# Altium project u2c.PrjPcb
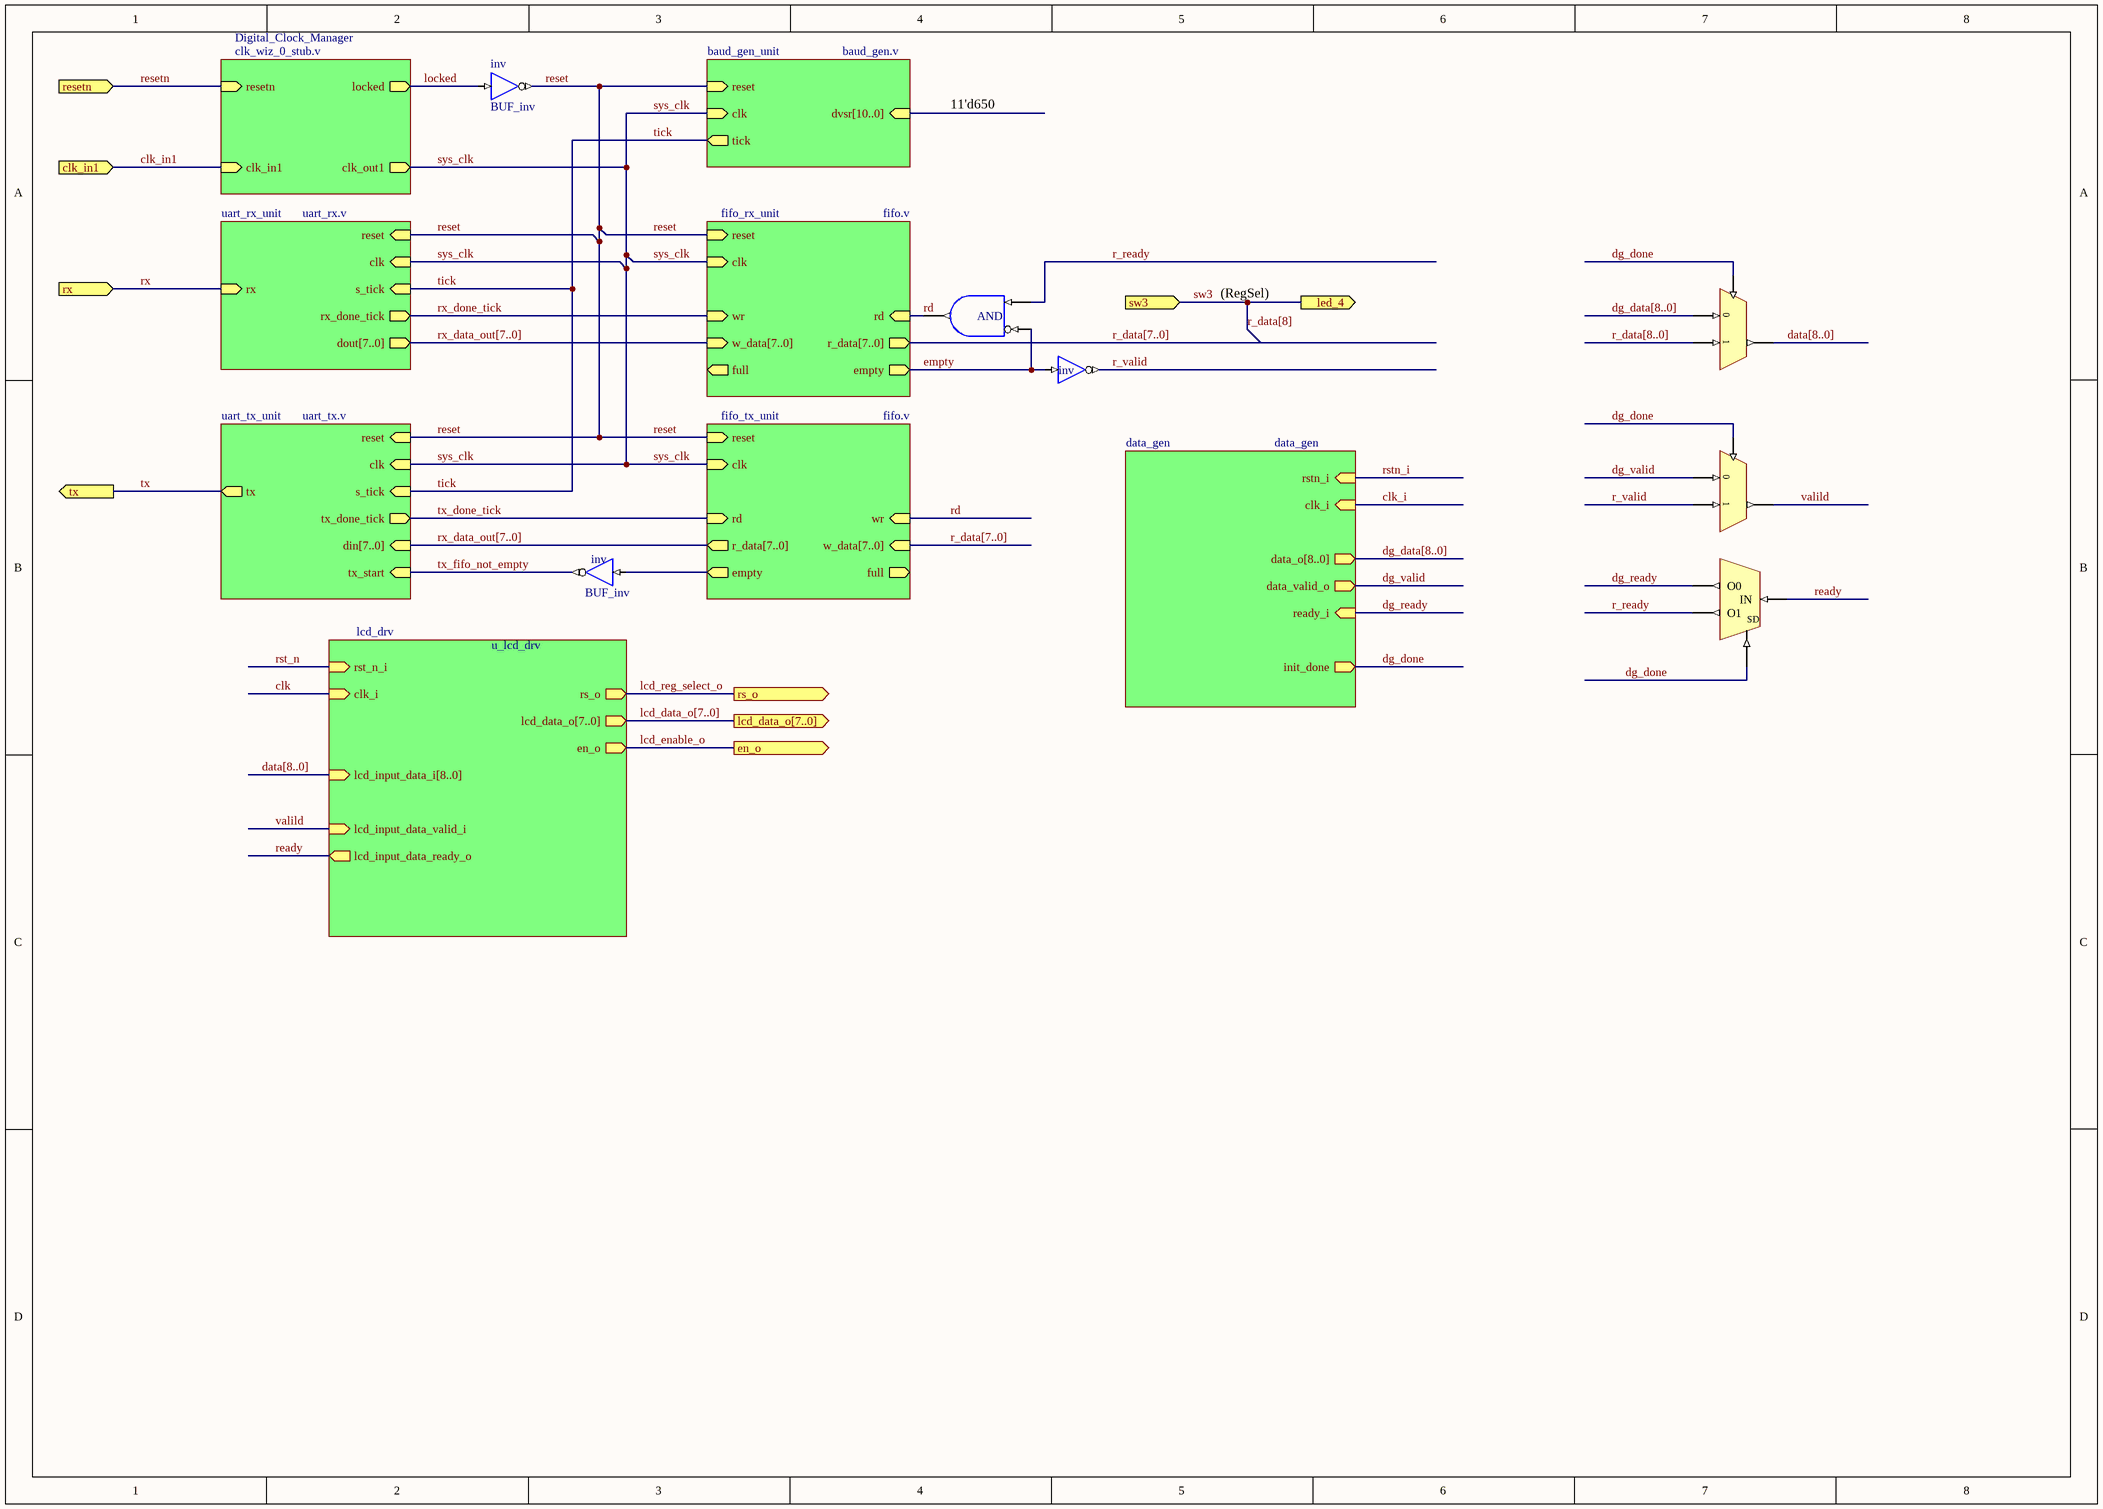
[diagram p0: u2c_bs.SchDoc]
1 sheet, 7 parts. Net scope: hierarchical (ports join the sheet entries above them; power ports are global).

## Sheet u2c_bs.SchDoc
size A3

### Parts
(Parts that share a designator on the sheet are numbered #1, #2 ... from top to bottom, then left to right.)
inv#1  BUF_inv
inv#2  BUF_inv  (value not drawn)
inv#3  BUF_inv
U?#1  AND
U?#2  MUX21  (value not drawn)
U?#3  MUX21  (value not drawn)
U?#4  DEMUX_1x2  (value not drawn)

### Sub-sheets
baud_gen_unit = baud_gen.v (file not in this document): reset (in), clk (in), tick (out), dvsr[10..0] (in)
data_gen = data_gen (file not in this document): data_o[8..0] (out), data_valid_o (out), ready_i (in), clk_i (in), rstn_i (in), init_done (out)
Digital_Clock_Manager = clk_wiz_0_stub.v (file not in this document): resetn (in), clk_in1 (in), locked (out), clk_out1 (out)
fifo_rx_unit = fifo.v (file not in this document): reset (in), clk (in), full (out), w_data[7..0] (in), rd (in), wr (in), r_data[7..0] (out), empty (out)
fifo_tx_unit = fifo.v (file not in this document): reset (in), clk (in), full (out), w_data[7..0] (in), rd (in), wr (in), r_data[7..0] (out), empty (out)
lcd_drv = u_lcd_drv (file not in this document): rs_o (out), lcd_data_o[7..0] (out), en_o (out), clk_i (in), lcd_input_data_i[8..0] (in), lcd_input_data_valid_i (in), lcd_input_data_ready_o (out), rst_n_i (in)
uart_rx_unit = uart_rx.v (file not in this document): reset (in), clk (in), rx (in), s_tick (in), rx_done_tick (out), dout[7..0] (out)
uart_tx_unit = uart_tx.v (file not in this document): reset (in), clk (in), tx (out), s_tick (in), tx_done_tick (out), din[7..0] (in), tx_start (in)

### Ports
clk_in1 (in), en_o (out), lcd_data_o[7..0] (out), led_4 (out), resetn (in), rs_o (out), rx (in), sw3 (in), tx (out)

### Nets
clk: sheet lcd_drv/clk_i
clk_i: sheet data_gen/clk_i
clk_in1: port clk_in1, sheet Digital_Clock_Manager/clk_in1
dg_done: U?#2.SD U?#3.SD U?#4.SD ; sheet data_gen/init_done
dg_ready: U?#4.O0 ; sheet data_gen/ready_i
dg_valid: U?#3.D0 ; sheet data_gen/data_valid_o
empty: inv#2.I U?#1.B ; sheet fifo_rx_unit/empty
lcd_enable_o: port en_o, sheet lcd_drv/en_o
lcd_reg_select_o: port rs_o, sheet lcd_drv/rs_o
locked: inv#1.I ; sheet Digital_Clock_Manager/locked
r_data[8]: port sw3, port led_4  [also labelled sw3]
r_ready: U?#1.A U?#4.O1
r_valid: inv#2.O U?#3.D1
rd: U?#1.Y ; sheet fifo_rx_unit/rd, sheet fifo_tx_unit/wr
ready: U?#4.IN ; sheet lcd_drv/lcd_input_data_ready_o
reset: inv#1.O ; sheet uart_tx_unit/reset, sheet fifo_rx_unit/reset, sheet fifo_tx_unit/reset, sheet baud_gen_unit/reset, sheet uart_rx_unit/reset
resetn: port resetn, sheet Digital_Clock_Manager/resetn
rst_n: sheet lcd_drv/rst_n_i
rstn_i: sheet data_gen/rstn_i
rx: port rx, sheet uart_rx_unit/rx
rx_done_tick: sheet fifo_rx_unit/wr, sheet uart_rx_unit/rx_done_tick
sys_clk: sheet uart_tx_unit/clk, sheet fifo_rx_unit/clk, sheet fifo_tx_unit/clk, sheet Digital_Clock_Manager/clk_out1, sheet baud_gen_unit/clk, sheet uart_rx_unit/clk
tick: sheet uart_tx_unit/s_tick, sheet baud_gen_unit/tick, sheet uart_rx_unit/s_tick
tx: port tx, sheet uart_tx_unit/tx
tx_done_tick: sheet uart_tx_unit/tx_done_tick, sheet fifo_tx_unit/rd
tx_fifo_not_empty: inv#3.O ; sheet uart_tx_unit/tx_start
valild: U?#3.Z ; sheet lcd_drv/lcd_input_data_valid_i
Netinv#3_I: inv#3.I ; sheet fifo_tx_unit/empty

Not connected (* = marked no-connect by the designer): U?#2 D0 D1 Z

### Buses and harness runs
bus data[8..0]
bus data[8..0] = sheet lcd_drv/lcd_input_data_i[8..0]
bus dg_data[8..0]
bus dg_data[8..0] = sheet data_gen/data_o[8..0]
bus lcd_data_o[7..0] = port lcd_data_o[7..0] = sheet lcd_drv/lcd_data_o[7..0]
bus r_data[7..0] = sheet fifo_rx_unit/r_data[7..0]
bus r_data[7..0] = sheet fifo_tx_unit/w_data[7..0]
bus r_data[8..0]
bus rx_data_out[7..0] = sheet fifo_rx_unit/w_data[7..0] = sheet uart_rx_unit/dout[7..0]
bus rx_data_out[7..0] = sheet fifo_tx_unit/r_data[7..0] = sheet uart_tx_unit/din[7..0]

### Notes on the sheet
- 11'd650
- (RegSel)
- (in symbol MUX2_1_B) 0; 1

### Library data of the parts
inv#1-inv#3 = BUF_inv: 1-bit General Purpose (Non-inverting) Buffer
U?#1 = AND_2: 2 Input AND
U?#2 U?#3 = MUX2_1_B: 2 to 1 Mux
U?#4 = DEMUX_1x2: 2 to 1 Mux